# Altium schematic sheet Z80Console0002.SchDoc
size 381 x 266 mm; SheetNumber: 3; SheetTotal: 3
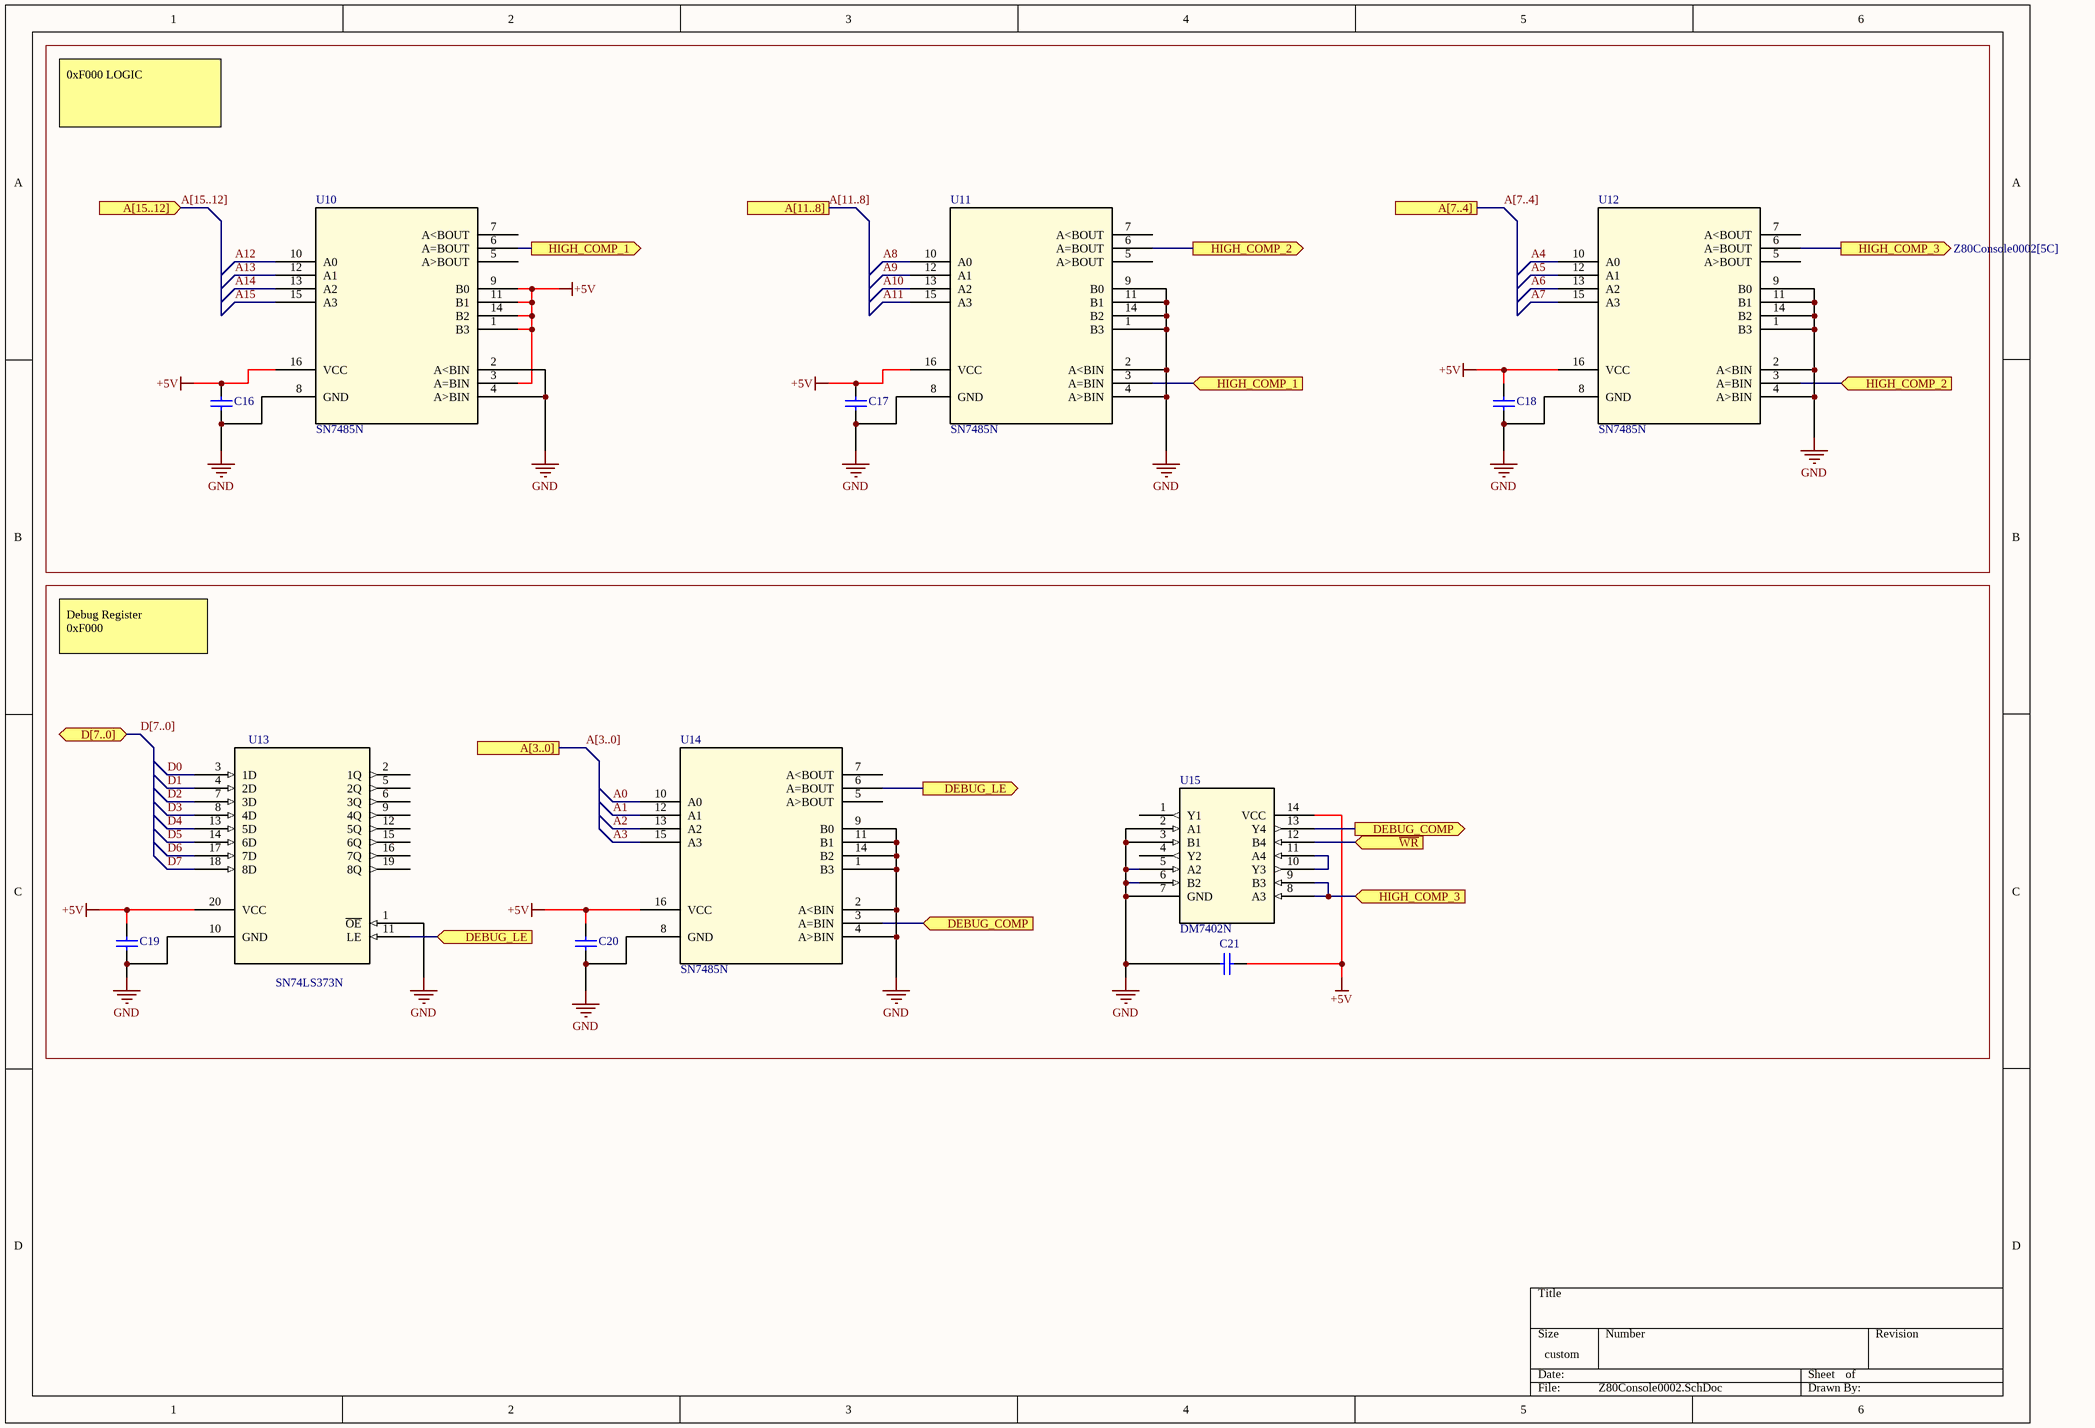
[diagram p0: Z80Console0002.SchDoc]

## Parts
C16  CAP  [CAPC0603(1608)100_N]  (value not drawn)
C17  CAP  [CAPC0603(1608)100_N]  (value not drawn)
C18  CAP  [CAPC0603(1608)100_N]  (value not drawn)
C19  CAP  [CAPC0603(1608)100_N]  (value not drawn)
C20  CAP  [CAPC0603(1608)100_N]  (value not drawn)
C21  CAP  [CAPC0603(1608)100_N]  (value not drawn)
U10  SN7485N  [DIP16_300]
U11  SN7485N  [DIP16_300]
U12  SN7485N  [DIP16_300]
U13  SN74LS373N  [N20]
U14  SN7485N  [DIP16_300]
U15  DM7402N  [PDIP14_19P56X6P35_ONS]

## Ports
A[3..0] (see Z80Console0000[2A], Z80Console0001[1B], Z80Console0001[1D]), A[7..4] (see Z80Console0000[2A], Z80Console0001[1B], Z80Console0001[1D]), A[11..8] (see Z80Console0000[2A], Z80Console0001[1B], Z80Console0001[1D]), A[15..12] (in, see Z80Console0000[2A], Z80Console0001[1B], Z80Console0001[1D], Z80Console0001[3A], Z80Console0001[3C]), D[7..0] (bidir, see Z80Console0000[2C], Z80Console0001[2B], Z80Console0001[2C]), DEBUG_COMP (in, see Z80Console0002[5C]), DEBUG_COMP (out, see Z80Console0002[3C]), DEBUG_LE (in, see Z80Console0002[3C]), DEBUG_LE (out, see Z80Console0002[2C]), HIGH_COMP_1 (in, see Z80Console0002[2A]), HIGH_COMP_1 (out, see Z80Console0002[4B]), HIGH_COMP_2 (in, see Z80Console0002[4A]), HIGH_COMP_2 (out, see Z80Console0002[6B]), HIGH_COMP_3 (in, see Z80Console0002[6A]), HIGH_COMP_3 (out, see Z80Console0002[5C]), ~{WR} (in, see Z80Console0000[1B], Z80Console0001[2C])

## Nets
+5V: C16.2 C17.2 C18.2 C19.2 C20.2 C21.2 U10.1(B3) U10.3(A=BIN) U10.9(B0) U10.11(B1) U10.14(B2) U10.16(VCC) U11.16(VCC) U12.16(VCC) U13.20(VCC) U14.16(VCC) U15.14(VCC)
GND: C16.1 C17.1 C18.1 C19.1 C20.1 C21.1 U10.2(A<BIN) U10.4(A>BIN) U10.8(GND) U11.1(B3) U11.2(A<BIN) U11.4(A>BIN) U11.8(GND) U11.9(B0) U11.11(B1) U11.14(B2) U12.1(B3) U12.2(A<BIN) U12.4(A>BIN) U12.8(GND) U12.9(B0) U12.11(B1) U12.14(B2) U13.1(~{OE}) U13.10(GND) U14.1(B3) U14.2(A<BIN) U14.4(A>BIN) U14.8(GND) U14.9(B0) U14.11(B1) U14.14(B2) U15.2(A1) U15.3(B1) U15.5(A2) U15.6(B2) U15.7(GND)
~{WR}: U15.12(B4) ; port ~{WR}
A0: U14.10(A0)
A1: U14.12(A1)
A2: U14.13(A2)
A3: U14.15(A3)
A4: U12.10(A0)
A5: U12.12(A1)
A6: U12.13(A2)
A7: U12.15(A3)
A8: U11.10(A0)
A9: U11.12(A1)
A10: U11.13(A2)
A11: U11.15(A3)
A12: U10.10(A0)
A13: U10.12(A1)
A14: U10.13(A2)
A15: U10.15(A3)
D0: U13.3(1D)
D1: U13.4(2D)
D2: U13.7(3D)
D3: U13.8(4D)
D4: U13.13(5D)
D5: U13.14(6D)
D6: U13.17(7D)
D7: U13.18(8D)
DEBUG_COMP: U14.3(A=BIN) U15.13(Y4) ; port DEBUG_COMP
DEBUG_LE: U13.11(LE) U14.6(A=BOUT) ; port DEBUG_LE
HIGH_COMP_1: U10.6(A=BOUT) U11.3(A=BIN) ; port HIGH_COMP_1
HIGH_COMP_2: U11.6(A=BOUT) U12.3(A=BIN) ; port HIGH_COMP_2
HIGH_COMP_3: U12.6(A=BOUT) U15.8(A3) U15.9(B3) ; port HIGH_COMP_3
NetU15_10: U15.10(Y3) U15.11(A4)

Not connected (* = marked no-connect by the designer): U10 5(A>BOUT) 7(A<BOUT); U11 5(A>BOUT) 7(A<BOUT); U12 5(A>BOUT) 7(A<BOUT); U13 2(1Q) 5(2Q) 6(3Q) 9(4Q) 12(5Q) 15(6Q) 16(7Q) 19(8Q); U14 5(A>BOUT) 7(A<BOUT); U15 1(Y1) 4(Y2)

## Buses and harness runs
bus A[3..0] = port A[3..0]
bus A[7..4] = port A[7..4]
bus A[11..8] = port A[11..8]
bus A[15..12] = port A[15..12]
bus D[7..0] = port D[7..0]

## Notes on the sheet
- 0xF000 LOGIC
- Debug Register
  0xF000

## Library data of the parts
U10-U12 U14 = SN7485N: 4-bit Magnitude Comparator; Manufacturer_Name: Texas Instruments; Copyright: Copyright (C) 2025 Ultra Librarian. All rights reserved.; Manufacturer_Part_Number: SN7485N; RefDes: RefDes; Type: Type
U13 = SN74LS373N: Octal D-type Transparent Latches with 3-state Outputs 20-PDIP 0 to 70; Manufacturer_Name: Texas Instruments; Copyright: Copyright (C) 2025 Ultra Librarian. All rights reserved.; Manufacturer_Part_Number: SN74LS373N; Datasheet: https://www.ti.com/lit/gpn/sn74ls373; RefDes: RefDes; Type: Type
U15 = DM7402N: NOR Gate; Manufacturer_Name: onsemi; Copyright: Copyright (C) 2025 Ultra Librarian. All rights reserved.; Manufacturer_Part_Number: DM7402N; RefDes: RefDes; Type: Type